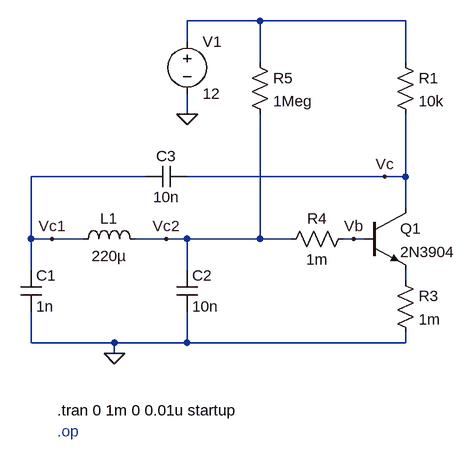
[diagram p0: schematic basic_colpitts_38_lc_tank_circuits_and_colpitts_oscillator.asc]
basic_colpitts_38_lc_tank_circuits_and_colpitts_oscillator.asc, the LTspice schematic file:
Version 4
SHEET 1 880 680
WIRE 400 -304 288 -304
WIRE 624 -304 400 -304
WIRE 288 -272 288 -304
WIRE 400 -240 400 -304
WIRE 624 -240 624 -304
WIRE 288 -160 288 -192
WIRE 224 -64 48 -64
WIRE 592 -64 288 -64
WIRE 624 -64 624 -160
WIRE 624 -64 592 -64
WIRE 624 -16 624 -64
WIRE 48 32 48 -64
WIRE 80 32 48 32
WIRE 128 32 80 32
WIRE 256 32 208 32
WIRE 288 32 256 32
WIRE 400 32 400 -160
WIRE 400 32 288 32
WIRE 448 32 400 32
WIRE 544 32 528 32
WIRE 560 32 544 32
WIRE 48 80 48 32
WIRE 288 80 288 32
WIRE 624 96 624 80
WIRE 48 192 48 144
WIRE 176 192 48 192
WIRE 288 192 288 144
WIRE 288 192 176 192
WIRE 624 192 624 176
WIRE 624 192 288 192
WIRE 176 208 176 192
FLAG 176 208 0
FLAG 288 -160 0
FLAG 544 32 Vb
FLAG 592 -64 Vc
FLAG 80 32 Vc1
FLAG 256 32 Vc2
SYMBOL cap 32 80 R0
SYMATTR InstName C1
SYMATTR Value 1n
SYMBOL cap 272 80 R0
SYMATTR InstName C2
SYMATTR Value 10n
SYMBOL ind 112 48 R270
WINDOW 0 32 56 VTop 2
WINDOW 3 5 56 VBottom 2
SYMATTR InstName L1
SYMATTR Value 220µ
SYMBOL npn 560 -16 R0
SYMATTR InstName Q1
SYMATTR Value 2N3904
SYMBOL res 608 -256 R0
SYMATTR InstName R1
SYMATTR Value 10k
SYMBOL voltage 288 -288 R0
WINDOW 123 0 0 Left 0
WINDOW 39 0 0 Left 0
SYMATTR InstName V1
SYMATTR Value 12
SYMBOL res 608 80 R0
SYMATTR InstName R3
SYMATTR Value 1m
SYMBOL res 432 48 R270
WINDOW 0 32 56 VTop 2
WINDOW 3 0 56 VBottom 2
SYMATTR InstName R4
SYMATTR Value 1m
SYMBOL res 384 -256 R0
SYMATTR InstName R5
SYMATTR Value 1Meg
SYMBOL cap 288 -80 R90
WINDOW 0 0 32 VBottom 2
WINDOW 3 32 32 VTop 2
SYMATTR InstName C3
SYMATTR Value 10n
TEXT 88 296 Left 2 !.tran 0 1m 0 0.01u startup
TEXT 88 328 Left 2 ;.op

The netlist it stands for:
* basic_colpitts_38_lc_tank_circuits_and_colpitts_oscillator.asc
C1 Vc1 0 1n
C2 Vc2 0 10n
L1 Vc1 Vc2 220µ
Q1 Vc Vb N002 0 2N3904
R1 N001 Vc 10k
V1 N001 0 12
R3 N002 0 1m
R4 Vc2 Vb 1m
R5 N001 Vc2 1Meg
C3 Vc Vc1 10n
.model NPN NPN
.model PNP PNP
.lib standard.bjt
.tran 0 1m 0 0.01u startup
* .op
.backanno
.end